# Altium schematic sheet Top.SchDoc
size A4; SheetNumber: 1; SheetTotal: 4
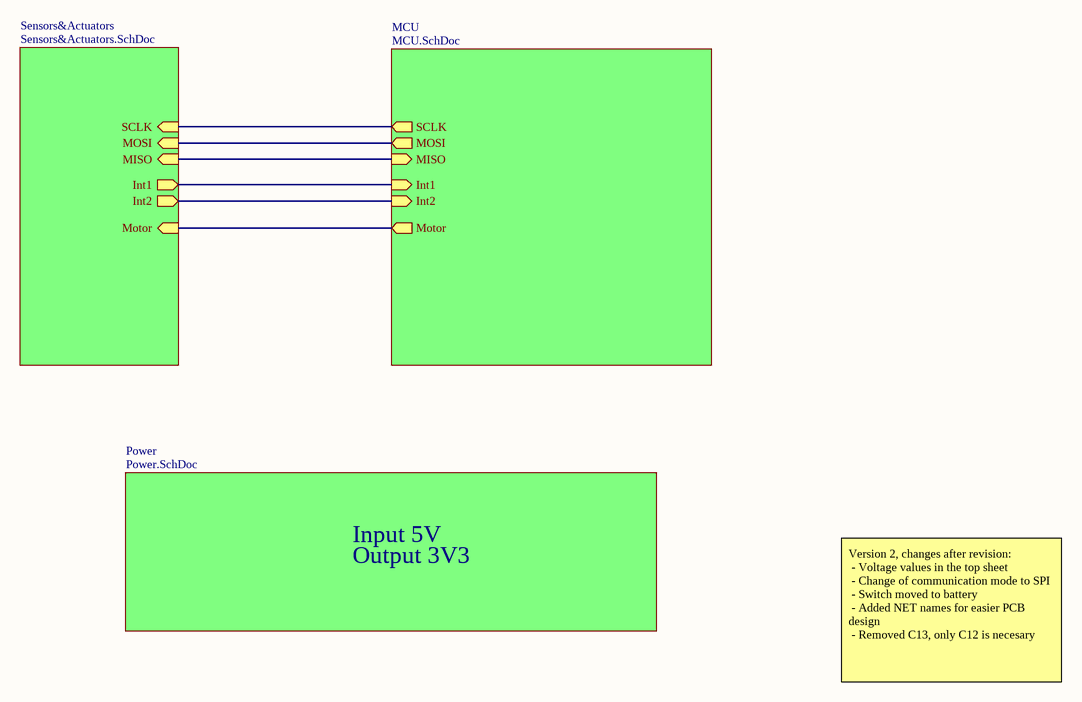
[diagram p0: Top.SchDoc]

## Sub-sheets
MCU = MCU.SchDoc: SCLK (out), MOSI (out), MISO (in), Motor (out), Int2 (in), Int1 (in)
Power = Power.SchDoc: no entries
Sensors&Actuators = Sensors&Actuators.SchDoc: Int1 (out), Int2 (out), MISO (in), Motor (in), SCLK (in), MOSI (in)

## Nets
(unnamed): sheet Sensors&Actuators/Int1, sheet MCU/Int1
(unnamed): sheet Sensors&Actuators/Int2, sheet MCU/Int2
(unnamed): sheet Sensors&Actuators/MISO, sheet MCU/MISO
(unnamed): sheet Sensors&Actuators/Motor, sheet MCU/Motor
(unnamed): sheet Sensors&Actuators/SCLK, sheet MCU/SCLK
(unnamed): sheet Sensors&Actuators/MOSI, sheet MCU/MOSI

## Notes on the sheet
- Input 5V
- Output 3V3
- Version 2, changes after revision:
  - Voltage values in the top sheet
  - Change of communication mode to SPI
  - Switch moved to battery
  - Added NET names for easier PCB design
  - Removed C13, only C12 is necesary
- Title:
- Drawn By:
- Page Contents:
- Size:
- Date:
- File:
- Engineers:
- Email:
- A4
- Number:
- Revision:
- Sheet
- of